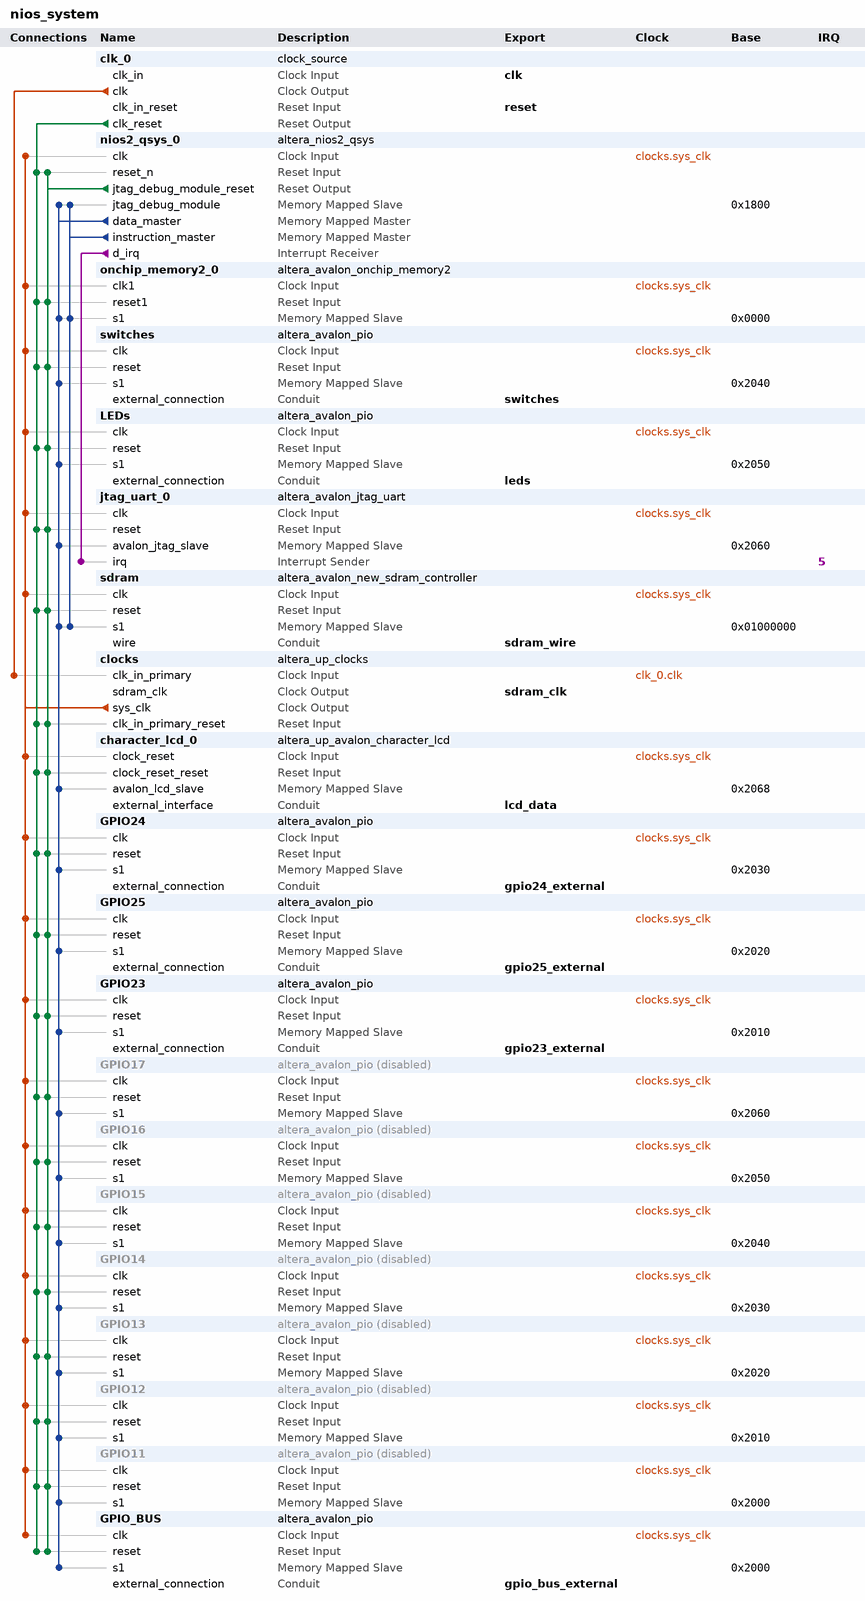
[diagram p0: system contents]
# Platform Designer (Qsys) system nios_system, Cyclone II EP2C35F672C6
# Parameters at their usual value, and those the tool derives, are not listed.
package require -exact qsys 13.0.1
create_system nios_system
set_project_property DEVICE_FAMILY {Cyclone II}
set_project_property DEVICE EP2C35F672C6

add_instance clk_0 clock_source 13.0
set_instance_parameter_value clk_0 clockFrequency 50000000

add_instance nios2_qsys_0 altera_nios2_qsys 13.0
set_instance_parameter_value nios2_qsys_0 resetSlave sdram.s1
set_instance_parameter_value nios2_qsys_0 mmu_TLBMissExcSlave None
set_instance_parameter_value nios2_qsys_0 exceptionSlave sdram.s1
set_instance_parameter_value nios2_qsys_0 breakSlave nios2_qsys_0.jtag_debug_module
set_instance_parameter_value nios2_qsys_0 impl Tiny
set_instance_parameter_value nios2_qsys_0 icache_size 4096

add_instance onchip_memory2_0 altera_avalon_onchip_memory2 13.0.1
set_instance_parameter_value onchip_memory2_0 dataWidth 32
set_instance_parameter_value onchip_memory2_0 dualPort false
set_instance_parameter_value onchip_memory2_0 initMemContent true
set_instance_parameter_value onchip_memory2_0 initializationFileName onchip_mem.hex
set_instance_parameter_value onchip_memory2_0 memorySize 4096

add_instance switches altera_avalon_pio 13.0.1
set_instance_parameter_value switches direction Input
set_instance_parameter_value switches width 8

add_instance LEDs altera_avalon_pio 13.0.1
set_instance_parameter_value LEDs direction Output
set_instance_parameter_value LEDs width 8

add_instance jtag_uart_0 altera_avalon_jtag_uart 13.0.1
set_instance_parameter_value jtag_uart_0 simInteractiveOptions NO_INTERACTIVE_WINDOWS

add_instance sdram altera_avalon_new_sdram_controller 13.0.1
set_instance_parameter_value sdram TAC 5.5
set_instance_parameter_value sdram TRCD 20.0
set_instance_parameter_value sdram TRP 20.0
set_instance_parameter_value sdram casLatency 3
set_instance_parameter_value sdram columnWidth 8
set_instance_parameter_value sdram dataWidth 16
set_instance_parameter_value sdram generateSimulationModel false
set_instance_parameter_value sdram model single_Micron_MT48LC4M32B2_7_chip
set_instance_parameter_value sdram numberOfBanks 4
set_instance_parameter_value sdram numberOfChipSelects 1
set_instance_parameter_value sdram powerUpDelay 100.0
set_instance_parameter_value sdram refreshPeriod 15.625
set_instance_parameter_value sdram rowWidth 12

add_instance clocks altera_up_clocks 13.0
set_instance_parameter_value clocks board DE2
set_instance_parameter_value clocks vga_clk false
set_instance_parameter_value clocks audio_clk false
set_instance_parameter_value clocks audio_clk_freq 12.288

add_instance character_lcd_0 altera_up_avalon_character_lcd 13.0
set_instance_parameter_value character_lcd_0 cursor Normal

add_instance GPIO24 altera_avalon_pio 13.0.1
set_instance_parameter_value GPIO24 direction Input
set_instance_parameter_value GPIO24 width 1

add_instance GPIO25 altera_avalon_pio 13.0.1
set_instance_parameter_value GPIO25 direction Input
set_instance_parameter_value GPIO25 width 1

add_instance GPIO23 altera_avalon_pio 13.0.1
set_instance_parameter_value GPIO23 direction Output
set_instance_parameter_value GPIO23 width 1

add_instance GPIO17 altera_avalon_pio 13.0.1
set_instance_property GPIO17 ENABLED false
set_instance_parameter_value GPIO17 direction Input
set_instance_parameter_value GPIO17 width 1

add_instance GPIO16 altera_avalon_pio 13.0.1
set_instance_property GPIO16 ENABLED false
set_instance_parameter_value GPIO16 direction Input
set_instance_parameter_value GPIO16 width 1

add_instance GPIO15 altera_avalon_pio 13.0.1
set_instance_property GPIO15 ENABLED false
set_instance_parameter_value GPIO15 direction Input
set_instance_parameter_value GPIO15 width 1

add_instance GPIO14 altera_avalon_pio 13.0.1
set_instance_property GPIO14 ENABLED false
set_instance_parameter_value GPIO14 direction Input
set_instance_parameter_value GPIO14 width 1

add_instance GPIO13 altera_avalon_pio 13.0.1
set_instance_property GPIO13 ENABLED false
set_instance_parameter_value GPIO13 direction Input
set_instance_parameter_value GPIO13 width 1

add_instance GPIO12 altera_avalon_pio 13.0.1
set_instance_property GPIO12 ENABLED false
set_instance_parameter_value GPIO12 direction Input
set_instance_parameter_value GPIO12 width 1

add_instance GPIO11 altera_avalon_pio 13.0.1
set_instance_property GPIO11 ENABLED false
set_instance_parameter_value GPIO11 direction Input
set_instance_parameter_value GPIO11 width 1

add_instance GPIO_BUS altera_avalon_pio 13.0.1
set_instance_parameter_value GPIO_BUS direction Input
set_instance_parameter_value GPIO_BUS width 7

# connections
add_connection clk_0.clk clocks.clk_in_primary clock
add_connection clocks.sys_clk character_lcd_0.clock_reset clock
add_connection clocks.sys_clk GPIO11.clk clock
add_connection clocks.sys_clk GPIO12.clk clock
add_connection clocks.sys_clk GPIO13.clk clock
add_connection clocks.sys_clk GPIO14.clk clock
add_connection clocks.sys_clk GPIO15.clk clock
add_connection clocks.sys_clk GPIO16.clk clock
add_connection clocks.sys_clk GPIO17.clk clock
add_connection clocks.sys_clk GPIO23.clk clock
add_connection clocks.sys_clk GPIO24.clk clock
add_connection clocks.sys_clk GPIO25.clk clock
add_connection clocks.sys_clk GPIO_BUS.clk clock
add_connection clocks.sys_clk jtag_uart_0.clk clock
add_connection clocks.sys_clk LEDs.clk clock
add_connection clocks.sys_clk nios2_qsys_0.clk clock
add_connection clocks.sys_clk onchip_memory2_0.clk1 clock
add_connection clocks.sys_clk sdram.clk clock
add_connection clocks.sys_clk switches.clk clock
add_connection clk_0.clk_reset character_lcd_0.clock_reset_reset reset
add_connection clk_0.clk_reset clocks.clk_in_primary_reset reset
add_connection clk_0.clk_reset GPIO11.reset reset
add_connection clk_0.clk_reset GPIO12.reset reset
add_connection clk_0.clk_reset GPIO13.reset reset
add_connection clk_0.clk_reset GPIO14.reset reset
add_connection clk_0.clk_reset GPIO15.reset reset
add_connection clk_0.clk_reset GPIO16.reset reset
add_connection clk_0.clk_reset GPIO17.reset reset
add_connection clk_0.clk_reset GPIO23.reset reset
add_connection clk_0.clk_reset GPIO24.reset reset
add_connection clk_0.clk_reset GPIO25.reset reset
add_connection clk_0.clk_reset GPIO_BUS.reset reset
add_connection clk_0.clk_reset jtag_uart_0.reset reset
add_connection clk_0.clk_reset LEDs.reset reset
add_connection clk_0.clk_reset nios2_qsys_0.reset_n reset
add_connection clk_0.clk_reset onchip_memory2_0.reset1 reset
add_connection clk_0.clk_reset sdram.reset reset
add_connection clk_0.clk_reset switches.reset reset
add_connection nios2_qsys_0.jtag_debug_module_reset character_lcd_0.clock_reset_reset reset
add_connection nios2_qsys_0.jtag_debug_module_reset clocks.clk_in_primary_reset reset
add_connection nios2_qsys_0.jtag_debug_module_reset GPIO11.reset reset
add_connection nios2_qsys_0.jtag_debug_module_reset GPIO12.reset reset
add_connection nios2_qsys_0.jtag_debug_module_reset GPIO13.reset reset
add_connection nios2_qsys_0.jtag_debug_module_reset GPIO14.reset reset
add_connection nios2_qsys_0.jtag_debug_module_reset GPIO15.reset reset
add_connection nios2_qsys_0.jtag_debug_module_reset GPIO16.reset reset
add_connection nios2_qsys_0.jtag_debug_module_reset GPIO17.reset reset
add_connection nios2_qsys_0.jtag_debug_module_reset GPIO23.reset reset
add_connection nios2_qsys_0.jtag_debug_module_reset GPIO24.reset reset
add_connection nios2_qsys_0.jtag_debug_module_reset GPIO25.reset reset
add_connection nios2_qsys_0.jtag_debug_module_reset GPIO_BUS.reset reset
add_connection nios2_qsys_0.jtag_debug_module_reset jtag_uart_0.reset reset
add_connection nios2_qsys_0.jtag_debug_module_reset LEDs.reset reset
add_connection nios2_qsys_0.jtag_debug_module_reset nios2_qsys_0.reset_n reset
add_connection nios2_qsys_0.jtag_debug_module_reset onchip_memory2_0.reset1 reset
add_connection nios2_qsys_0.jtag_debug_module_reset sdram.reset reset
add_connection nios2_qsys_0.jtag_debug_module_reset switches.reset reset
add_connection nios2_qsys_0.data_master character_lcd_0.avalon_lcd_slave avalon
set_connection_parameter_value nios2_qsys_0.data_master/character_lcd_0.avalon_lcd_slave baseAddress 0x2068
add_connection nios2_qsys_0.data_master GPIO11.s1 avalon
set_connection_parameter_value nios2_qsys_0.data_master/GPIO11.s1 baseAddress 0x2000
add_connection nios2_qsys_0.data_master GPIO12.s1 avalon
set_connection_parameter_value nios2_qsys_0.data_master/GPIO12.s1 baseAddress 0x2010
add_connection nios2_qsys_0.data_master GPIO13.s1 avalon
set_connection_parameter_value nios2_qsys_0.data_master/GPIO13.s1 baseAddress 0x2020
add_connection nios2_qsys_0.data_master GPIO14.s1 avalon
set_connection_parameter_value nios2_qsys_0.data_master/GPIO14.s1 baseAddress 0x2030
add_connection nios2_qsys_0.data_master GPIO15.s1 avalon
set_connection_parameter_value nios2_qsys_0.data_master/GPIO15.s1 baseAddress 0x2040
add_connection nios2_qsys_0.data_master GPIO16.s1 avalon
set_connection_parameter_value nios2_qsys_0.data_master/GPIO16.s1 baseAddress 0x2050
add_connection nios2_qsys_0.data_master GPIO17.s1 avalon
set_connection_parameter_value nios2_qsys_0.data_master/GPIO17.s1 baseAddress 0x2060
add_connection nios2_qsys_0.data_master GPIO23.s1 avalon
set_connection_parameter_value nios2_qsys_0.data_master/GPIO23.s1 baseAddress 0x2010
add_connection nios2_qsys_0.data_master GPIO24.s1 avalon
set_connection_parameter_value nios2_qsys_0.data_master/GPIO24.s1 baseAddress 0x2030
add_connection nios2_qsys_0.data_master GPIO25.s1 avalon
set_connection_parameter_value nios2_qsys_0.data_master/GPIO25.s1 baseAddress 0x2020
add_connection nios2_qsys_0.data_master GPIO_BUS.s1 avalon
set_connection_parameter_value nios2_qsys_0.data_master/GPIO_BUS.s1 baseAddress 0x2000
add_connection nios2_qsys_0.data_master jtag_uart_0.avalon_jtag_slave avalon
set_connection_parameter_value nios2_qsys_0.data_master/jtag_uart_0.avalon_jtag_slave baseAddress 0x2060
add_connection nios2_qsys_0.data_master LEDs.s1 avalon
set_connection_parameter_value nios2_qsys_0.data_master/LEDs.s1 baseAddress 0x2050
add_connection nios2_qsys_0.data_master nios2_qsys_0.jtag_debug_module avalon
set_connection_parameter_value nios2_qsys_0.data_master/nios2_qsys_0.jtag_debug_module baseAddress 0x1800
add_connection nios2_qsys_0.data_master onchip_memory2_0.s1 avalon
set_connection_parameter_value nios2_qsys_0.data_master/onchip_memory2_0.s1 baseAddress 0x0000
add_connection nios2_qsys_0.data_master sdram.s1 avalon
set_connection_parameter_value nios2_qsys_0.data_master/sdram.s1 baseAddress 0x01000000
add_connection nios2_qsys_0.data_master switches.s1 avalon
set_connection_parameter_value nios2_qsys_0.data_master/switches.s1 baseAddress 0x2040
add_connection nios2_qsys_0.instruction_master nios2_qsys_0.jtag_debug_module avalon
set_connection_parameter_value nios2_qsys_0.instruction_master/nios2_qsys_0.jtag_debug_module baseAddress 0x1800
add_connection nios2_qsys_0.instruction_master onchip_memory2_0.s1 avalon
set_connection_parameter_value nios2_qsys_0.instruction_master/onchip_memory2_0.s1 baseAddress 0x0000
add_connection nios2_qsys_0.instruction_master sdram.s1 avalon
set_connection_parameter_value nios2_qsys_0.instruction_master/sdram.s1 baseAddress 0x01000000
add_connection nios2_qsys_0.d_irq jtag_uart_0.irq interrupt
set_connection_parameter_value nios2_qsys_0.d_irq/jtag_uart_0.irq irqNumber 5

# exported interfaces
add_interface clk clock sink
set_interface_property clk EXPORT_OF clk_0.clk_in
add_interface switches conduit end
set_interface_property switches EXPORT_OF switches.external_connection
add_interface leds conduit end
set_interface_property leds EXPORT_OF LEDs.external_connection
add_interface sdram_wire conduit end
set_interface_property sdram_wire EXPORT_OF sdram.wire
add_interface reset reset sink
set_interface_property reset EXPORT_OF clk_0.clk_in_reset
add_interface sdram_clk clock source
set_interface_property sdram_clk EXPORT_OF clocks.sdram_clk
add_interface lcd_data conduit end
set_interface_property lcd_data EXPORT_OF character_lcd_0.external_interface
add_interface gpio24_external conduit end
set_interface_property gpio24_external EXPORT_OF GPIO24.external_connection
add_interface gpio25_external conduit end
set_interface_property gpio25_external EXPORT_OF GPIO25.external_connection
add_interface gpio23_external conduit end
set_interface_property gpio23_external EXPORT_OF GPIO23.external_connection
add_interface gpio_bus_external conduit end
set_interface_property gpio_bus_external EXPORT_OF GPIO_BUS.external_connection

set_interconnect_requirement {$system} qsys_mm.clockCrossingAdapter HANDSHAKE
set_interconnect_requirement {$system} qsys_mm.maxAdditionalLatency 1

save_system nios_system.qsys
